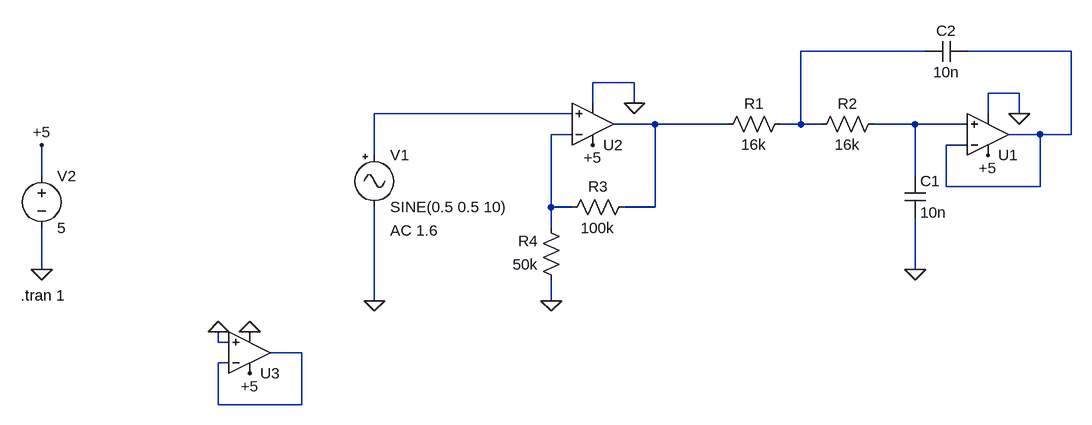
[diagram p0: schematic Signal.asc]
Signal.asc, the LTspice schematic file:
Version 4
SHEET 1 880 680
WIRE 512 -32 320 -32
WIRE 736 -32 576 -32
WIRE 64 16 0 16
WIRE 656 32 608 32
WIRE 0 48 0 16
WIRE 64 48 64 16
WIRE -32 64 -336 64
WIRE 608 64 608 32
WIRE 656 64 656 32
WIRE 96 80 32 80
WIRE 208 80 96 80
WIRE 320 80 320 -32
WIRE 320 80 288 80
WIRE 352 80 320 80
WIRE 496 80 432 80
WIRE 576 80 496 80
WIRE -32 96 -64 96
WIRE 688 96 640 96
WIRE 736 96 736 -32
WIRE 736 96 688 96
WIRE 576 112 544 112
WIRE -336 128 -336 64
WIRE -848 160 -848 112
WIRE 496 160 496 80
WIRE 544 176 544 112
WIRE 688 176 688 96
WIRE 688 176 544 176
WIRE -64 208 -64 96
WIRE -32 208 -64 208
WIRE 96 208 96 80
WIRE 96 208 48 208
WIRE -64 240 -64 208
WIRE -848 304 -848 240
WIRE 496 304 496 224
WIRE -336 352 -336 208
WIRE -64 352 -64 320
WIRE -576 416 -576 400
WIRE -560 416 -576 416
WIRE -448 432 -496 432
WIRE -560 448 -576 448
WIRE -576 512 -576 448
WIRE -448 512 -448 432
WIRE -448 512 -576 512
FLAG -848 112 +5
FLAG -848 304 0
FLAG 496 304 0
FLAG 608 128 +5
FLAG 656 64 0
FLAG -64 352 0
FLAG -336 352 0
FLAG 0 112 +5
FLAG 64 48 0
FLAG -528 464 +5
FLAG -528 400 0
FLAG -576 400 0
SYMBOL Misc\\signal -336 112 R0
WINDOW 123 24 132 Left 2
WINDOW 39 0 0 Left 0
SYMATTR Value2 AC 1.6
SYMATTR InstName V1
SYMATTR Value SINE(0.5 0.5 10)
SYMBOL voltage -848 144 R0
WINDOW 123 0 0 Left 0
WINDOW 39 0 0 Left 0
SYMATTR InstName V2
SYMATTR Value 5
SYMBOL res 304 64 R90
WINDOW 0 0 56 VBottom 2
WINDOW 3 32 56 VTop 2
SYMATTR InstName R1
SYMATTR Value 16k
SYMBOL res 448 64 R90
WINDOW 0 0 56 VBottom 2
WINDOW 3 32 56 VTop 2
SYMATTR InstName R2
SYMATTR Value 16k
SYMBOL cap 480 160 R0
SYMATTR InstName C1
SYMATTR Value 10n
SYMBOL cap 576 -48 R90
WINDOW 0 0 32 VBottom 2
WINDOW 3 32 32 VTop 2
SYMATTR InstName C2
SYMATTR Value 10n
SYMBOL Opamps\\UniversalOpamp2 608 96 M180
SYMATTR InstName U1
SYMBOL Opamps\\UniversalOpamp2 0 80 M180
SYMATTR InstName U2
SYMBOL res 64 192 R90
WINDOW 0 0 56 VBottom 2
WINDOW 3 32 56 VTop 2
SYMATTR InstName R3
SYMATTR Value 100k
SYMBOL res -48 336 R180
WINDOW 0 36 76 Left 2
WINDOW 3 36 40 Left 2
SYMATTR InstName R4
SYMATTR Value 50k
SYMBOL Opamps\\UniversalOpamp2 -528 432 M180
SYMATTR InstName U3
TEXT -880 344 Left 2 !.tran 1

The netlist it stands for:
* Signal.asc
V1 N003 0 SINE(0.5 0.5 10) AC 1.6
V2 +5 0 5
R1 N001 N004 16k
R2 N005 N001 16k
C1 N005 0 10n
C2 N002 N001 10n
XU1 N005 N002 +5 0 N002 level.2 Avol=1Meg GBW=10Meg Slew=10Meg ilimit=25m rail=0 Vos=0 phimargin=45 en=0 enk=0 in=0 ink=0 Rin=500Meg  ; pins IN+ IN- V+ V- OUT
XU2 N003 N006 +5 0 N004 level.2 Avol=1Meg GBW=10Meg Slew=10Meg ilimit=25m rail=0 Vos=0 phimargin=45 en=0 enk=0 in=0 ink=0 Rin=500Meg  ; pins IN+ IN- V+ V- OUT
R3 N004 N006 100k
R4 0 N006 50k
XU3 0 N007 +5 0 N007 level.2 Avol=1Meg GBW=10Meg Slew=10Meg ilimit=25m rail=0 Vos=0 phimargin=45 en=0 enk=0 in=0 ink=0 Rin=500Meg  ; pins IN+ IN- V+ V- OUT
.tran 1
.lib UniversalOpamps2.sub
.backanno
.end